# Altium schematic sheet Sheet1.SchDoc
size A1
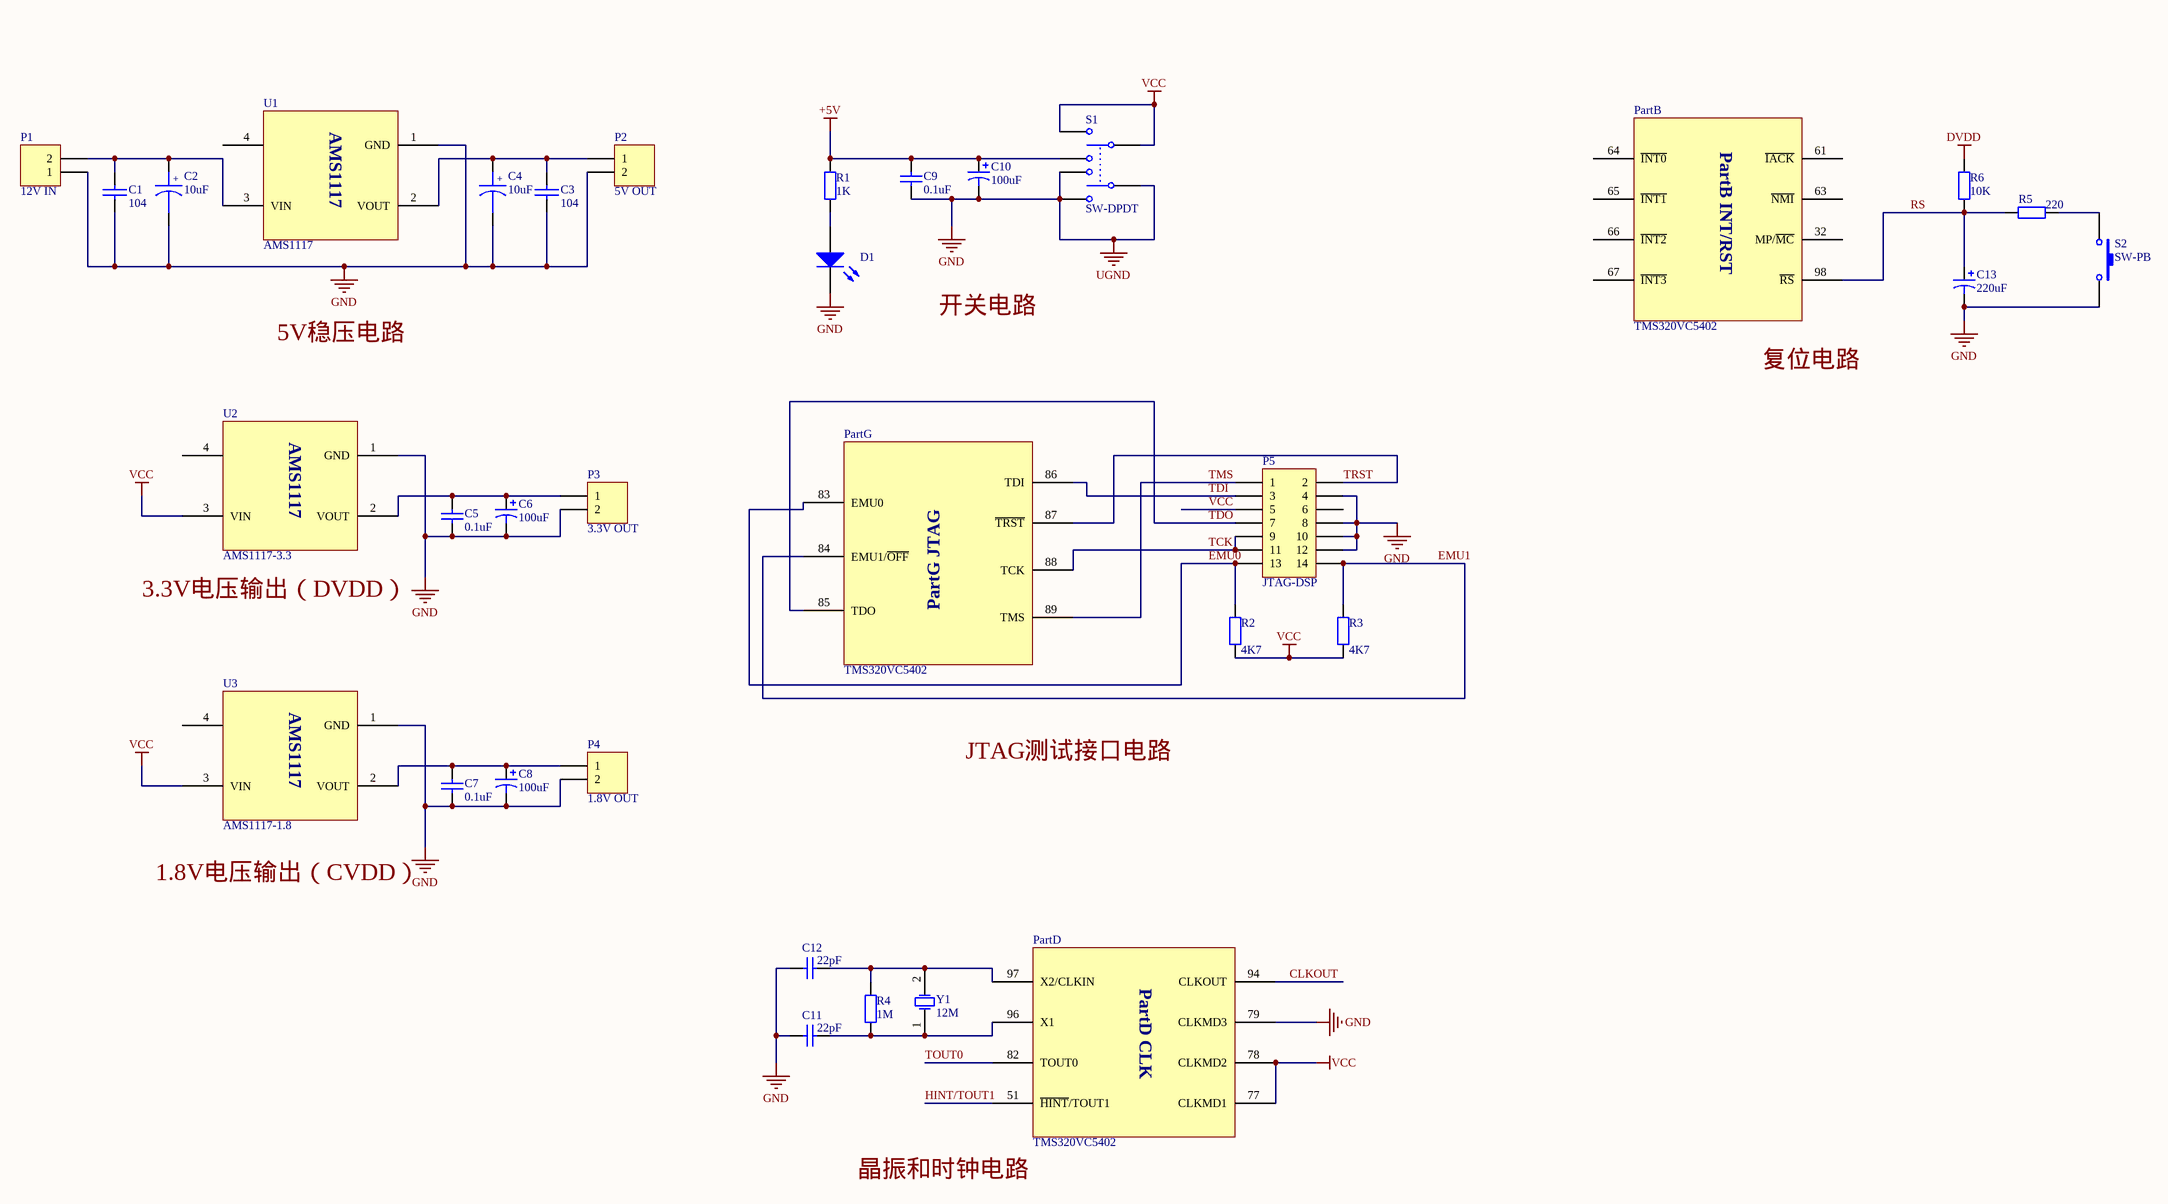
[diagram p0: Sheet1.SchDoc]

## Parts
C1  104  [C/5/4/2/R2]
C2  10uF
C3  104  [C/5/4/2/R2]
C4  10uF
C5  value 0.1uF  [RAD-0.3]  (hidden comment: Cap)
C6  value 100uF  [RB7.6-15]  (hidden comment: Cap Pol1)
C7  value 0.1uF  [RAD-0.3]  (hidden comment: Cap)
C8  value 100uF  [RB7.6-15]  (hidden comment: Cap Pol1)
C9  value 0.1uF  [RAD-0.3]  (hidden comment: Cap)
C10  value 100uF  [RB7.6-15]  (hidden comment: Cap Pol1)
C11  value 22pF  [RAD-0.3]  (hidden comment: Cap)
C12  value 22pF  [RAD-0.3]  (hidden comment: Cap)
C13  value 220uF  [RB7.6-15]  (hidden comment: Cap Pol1)
D1  LED0  [LED-0]  (value not drawn)
P1  12V IN  [HDR1X2]
P2  5V OUT  [HDR1X2]
P3  3.3V OUT  [HDR1X2]
P4  1.8V OUT  [HDR1X2]
P5  JTAG-DSP  [HDR2X7]
Part  TMS320VC5402  (parts B,D,G of 8)
R1  value 1K  [AXIAL-0.4]  (hidden comment: Res2)
R2  value 4K7  [AXIAL-0.4]  (hidden comment: Res2)
R3  value 4K7  [AXIAL-0.4]  (hidden comment: Res2)
R4  value 1M  [AXIAL-0.4]  (hidden comment: Res2)
R5  value 220  [AXIAL-0.4]  (hidden comment: Res2)
R6  value 10K  [AXIAL-0.4]  (hidden comment: Res2)
S1  SW-DPDT  [DPDT-6]
S2  SW-PB  [SPST-2]
U1  AMS1117
U2  AMS1117-3.3
U3  AMS1117-1.8
Y1  12M  [R38]

## Nets
+5V: C9.2 C10.1 R1.1 S1.5
DVDD: R6.2
GND: C1.2 C2.2 C3.1 C4.2 C5.1 C6.2 C7.1 C8.2 C9.1 C10.2 C11.1 C12.1 C13.2 D1.2(K) P1.1 P2.2 P3.2 P4.2 P5.4 P5.8 P5.10 P5.12 Part.79(CLKMD3) S1.1 S1.2 S1.3 S2.2 U1.1(GND) U2.1(GND) U3.1(GND)  [also labelled UGND]
VCC: Part.77(CLKMD1) Part.78(CLKMD2) R2.1 R3.1 S1.4 S1.6 U2.3(VIN) U3.3(VIN)
NetC1_1: C1.1 C2.1 P1.2 U1.3(VIN)
NetC3_2: C3.2 C4.1 P2.1 U1.2(VOUT)
NetC5_2: C5.2 C6.1 P3.1 U2.2(VOUT)
NetC7_2: C7.2 C8.1 P4.1 U3.2(VOUT)
NetC11_2: C11.2 Part.96(X1) R4.2 Y1.1(OSC1)
NetC12_2: C12.2 Part.97(X2/CLKIN) R4.1 Y1.2(OSC2)
NetC13_1: C13.1 Part.98(~{RS}) R5.1 R6.1
NetD1_1: D1.1(A) R1.2
NetP5_1: P5.1 Part.89(TMS)
NetP5_2: P5.2 Part.87(~{TRST})
NetP5_3: P5.3 Part.86(TDI)
NetP5_7: P5.7 Part.85(TDO)
NetP5_9: P5.9 P5.11 Part.88(TCK)
NetP5_13: P5.13 Part.83(EMU0) R2.2
NetP5_14: P5.14 Part.84(EMU1/~{OFF}) R3.2
NetR5_2: R5.2 S2.1

Not connected (* = marked no-connect by the designer): P5 5 6; Part 32(MP/~{MC}) 51(~{HINT}/TOUT1) 61(~{IACK}) 63(~{NMI}) 64(~{INT0}) 65(~{INT1}) 66(~{INT2}) 67(~{INT3}) 82(TOUT0) 94(CLKOUT); U1 4(3); U2 4(3); U3 4(3)

## Notes on the sheet
- (near R6) RS
- (near P5) TMS
- (near P5) TDI
- (near P5) TRST
- (near P5) VCC
- (near P5) TDO
- (near P5) TCK
- (near P5) EMU0
- EMU1
- CLKOUT
- TOUT0
- (near Part) HINT/TOUT1
- Labels drawn without touching a wire or pin: 1.8V电压输出（CVDD）, 3.3V电压输出（DVDD）, 5V稳压电路, JTAG测试接口电路, 复位电路, 开关电路, 晶振和时钟电路
- (in symbol CAPACITOR POL) +
- (in symbol TMS320VC5402, part B) PartB INT/RST
- (in symbol TMS320VC5402, part D) PartD CLK
- (in symbol TMS320VC5402, part G) PartG JTAG

## Library data of the parts
C1 C3 = CAP: Capacitor
C2 C4 = CAPACITOR POL: Capacitor
C5 C7 C9 C11 C12 = Cap: Capacitor; Published: 8-Jun-2000; LatestRevisionDate: 17-Jul-2002; LatestRevisionNote: Re-released for DXP Platform.; PackageReference: RAD-0.3; Publisher: Altium Limited
C6 C8 C10 C13 = Cap Pol1: Polarized Capacitor (Radial); Published: 8-Jun-2000; LatestRevisionDate: 17-Jul-2002; LatestRevisionNote: Re-released for DXP Platform.; PackageReference: RB7.6-15; Publisher: Altium Limited
D1 = LED0: Typical INFRARED GaAs LED; Published: 8-Jun-2000; LatestRevisionDate: 08-Jul-2005; LatestRevisionNote: Mech Layer 1 removed.; PackageReference: LED-0; Publisher: Altium Limited
P1-P4 = Header 2: Header, 2-Pin; LatestRevisionDate: 17-Jul-2002; LatestRevisionNote: Re-released for DXP Platform.; Publisher: Altium Limited
P5 = Header 7X2: Header, 7-Pin, Dual row; LatestRevisionDate: 17-Jul-2002; LatestRevisionNote: Re-released for DXP Platform.; Publisher: Altium Limited
R1-R6 = Res2: Resistor; Published: 8-Jun-2000; LatestRevisionDate: 17-Jul-2002; LatestRevisionNote: Re-released for DXP Platform.; PackageReference: AXIAL-0.4; Publisher: Altium Limited
S1 = SW-DPDT: Double-Pole, Double-Throw Switch; Published: 24-Mar-1999; LatestRevisionDate: 17-Jul-2002; LatestRevisionNote: Re-released for DXP Platform.; PackageReference: DPDT-6; Publisher: Altium Limited
S2 = SW-PB: Switch; Published: 24-Mar-1999; LatestRevisionDate: 17-Jul-2002; LatestRevisionNote: Re-released for DXP Platform.; PackageReference: SPST-2; Publisher: Altium Limited
U2 U3 = AMS1117
Y1 = XTAL: Crystal Oscillator; Published: 8-Jun-2000; LatestRevisionDate: 17-Jul-2002; LatestRevisionNote: Re-released for DXP Platform.; PackageReference: R38; Publisher: Altium Limited